# Altium schematic sheet Sensors.SchDoc
size 431 x 279 mm; SheetNumber: 2; SheetTotal: 4
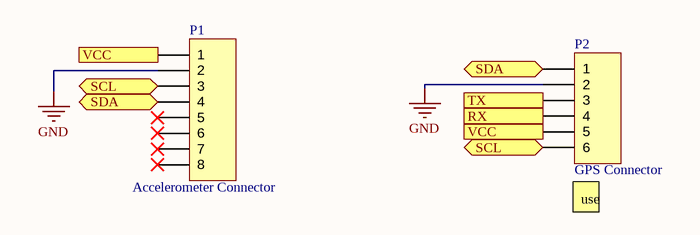
[diagram p0: Sensors.SchDoc]

## Parts
P1  Accelerometer Connector  [HDR1X8]
P2  GPS Connector  [HDR1X6]

## Ports
RX (in), SCL (bidir), SDA (bidir), TX (out), VCC (in)

## Nets
GND: P1.2 P2.2
RX: P2.4 ; port RX
SCL: P1.3 P2.6 ; port SCL
SDA: P1.4 P2.1 ; port SDA
TX: P2.3 ; port TX
VCC: P1.1 P2.5 ; port VCC

Not connected (* = marked no-connect by the designer): P1 5* 6* 7* 8*

## Notes on the sheet
- (near P2) use Micro-Fit Vertical 6 pin connector  #:0436500618
- DWG. NO.
- REV.
- SHT.
- THIS DOCUMENT AND THE DATA DISCLOSED HEREIN OR HEREWITH IS THE PROPERTY OF ALTIUM LIMITED AND MAY BE FREELY DISTRIBUTED IN WHOLE. NO RIGHTS ARE RESERVED OR EXPRESS OR IMPLIED WARANTEE GIVEN.
- REVISION
- DESCRIPTION
- DATE
- APPROVED
- ENG:
- APPROVALS
- PROJECT
- DSN:
- CHK:
- REFERENCE DOCUMENTS
- PROJECT REVISION:
- TITLE
- DOCUMENT REVISION:
- DESIGN ITEM:
- BOM:
- FAB DWG:
- PCB DWG:
- ASSY DWG:
- SCALE:
- SIZE
- B
- CAGE CODE
- FILE NAME
- DWG NO.
- SHEET
- OF
- REV

## Library data of the parts
P1 = Header 8: Header, 8-Pin; LatestRevisionDate: 17-Jul-2002; LatestRevisionNote: Re-released for DXP Platform.; Publisher: Altium Limited
P2 = Header 6: Header, 6-Pin; LatestRevisionDate: 17-Jul-2002; LatestRevisionNote: Re-released for DXP Platform.; Publisher: Altium Limited